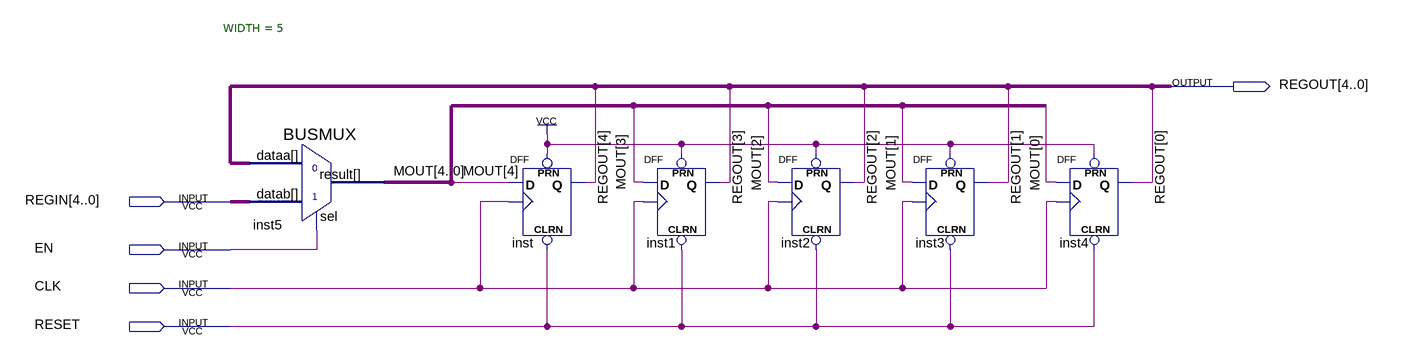
[diagram p0: schematic sheet]
// Quartus schematic Register5Bits.bdf as structural Verilog: 6 symbols, 5 pins
module Register5Bits (
  input  [4:0] REGIN,
  input  EN,
  input  CLK,
  input  RESET,
  output [4:0] REGOUT
);

  wire [4:0] MOUT;

  BUSMUX #(.WIDTH(5)) inst5 (.datab(REGIN), .sel(EN), .dataa(REGOUT), .result(MOUT));
  DFF inst (.CLRN(RESET), .CLK(CLK), .D(MOUT[4]), .PRN(1'b1), .Q(REGOUT[4]));
  DFF inst1 (.CLRN(RESET), .CLK(CLK), .D(MOUT[3]), .PRN(1'b1), .Q(REGOUT[3]));
  DFF inst2 (.CLRN(RESET), .CLK(CLK), .D(MOUT[2]), .PRN(1'b1), .Q(REGOUT[2]));
  DFF inst3 (.CLRN(RESET), .CLK(CLK), .D(MOUT[1]), .PRN(1'b1), .Q(REGOUT[1]));
  DFF inst4 (.CLRN(RESET), .CLK(CLK), .D(MOUT[0]), .PRN(1'b1), .Q(REGOUT[0]));
endmodule
